# Altium schematic sheet IR180-19_5GF.SchDoc
size A4
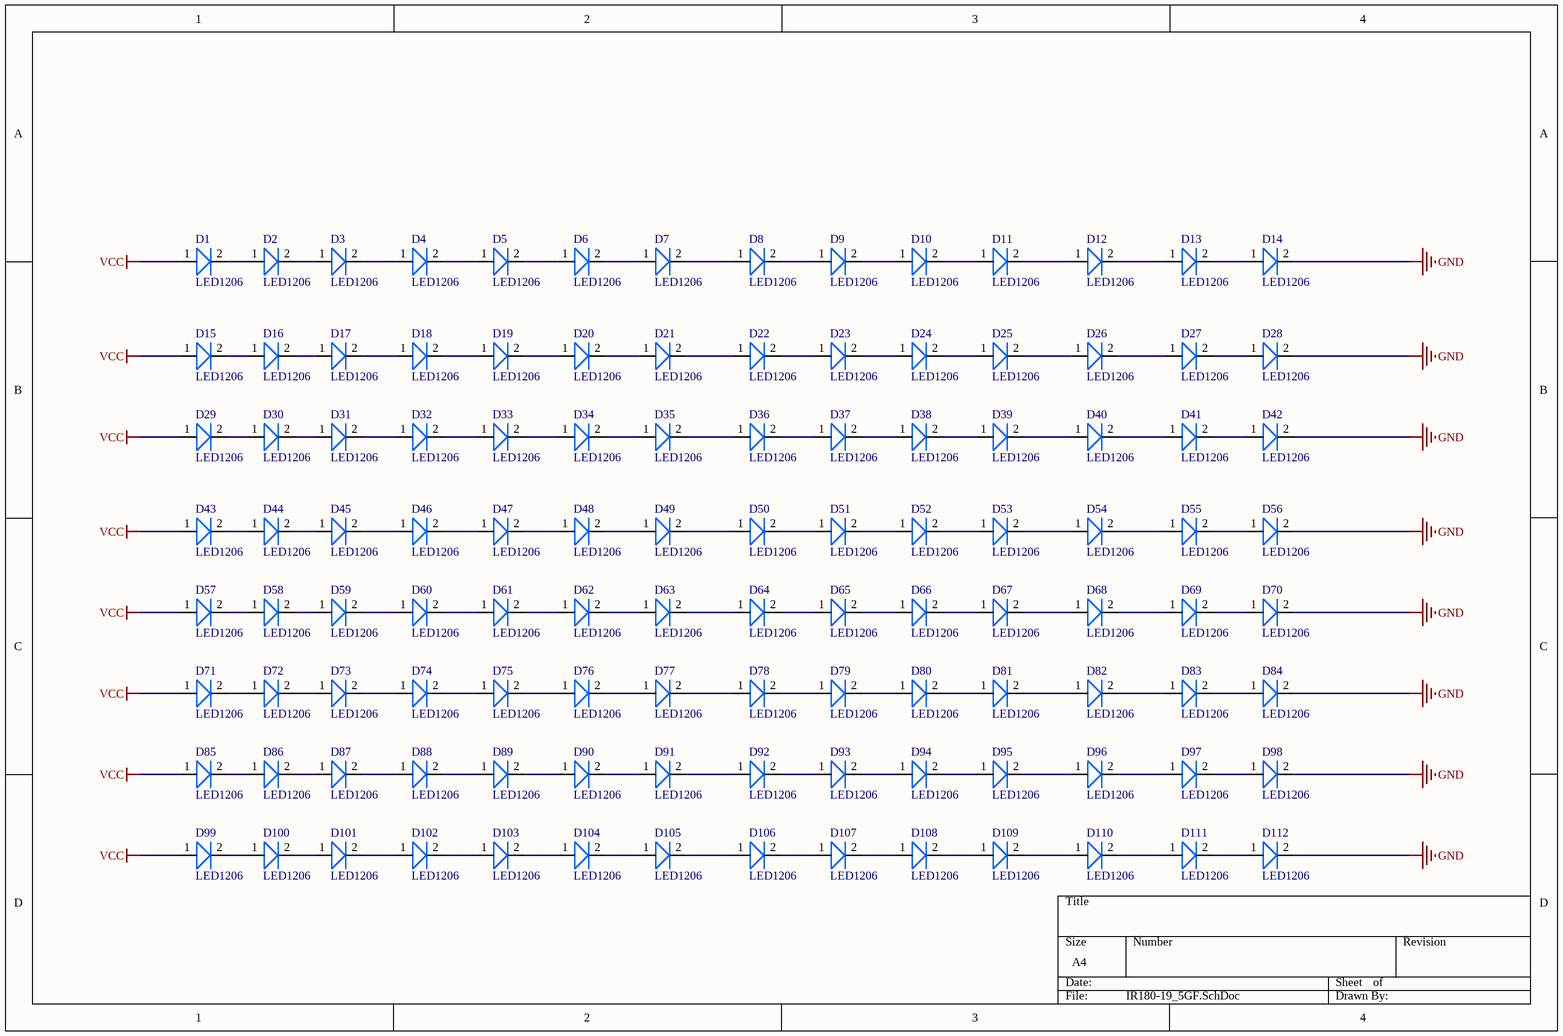
[diagram p0: IR180-19_5GF.SchDoc]

## Parts
D1  LED1206  [IRLED2835M]
D2  LED1206  [IRLED2835M]
D3  LED1206  [IRLED2835M]
D4  LED1206  [IRLED2835M]
D5  LED1206  [IRLED2835M]
D6  LED1206  [IRLED2835M]
D7  LED1206  [IRLED2835M]
D8  LED1206  [IRLED2835M]
D9  LED1206  [IRLED2835M]
D10  LED1206  [IRLED2835M]
D11  LED1206  [IRLED2835M]
D12  LED1206  [IRLED2835M]
D13  LED1206  [IRLED2835M]
D14  LED1206  [IRLED2835M]
D15  LED1206  [IRLED2835M]
D16  LED1206  [IRLED2835M]
D17  LED1206  [IRLED2835M]
D18  LED1206  [IRLED2835M]
D19  LED1206  [IRLED2835M]
D20  LED1206  [IRLED2835M]
D21  LED1206  [IRLED2835M]
D22  LED1206  [IRLED2835M]
D23  LED1206  [IRLED2835M]
D24  LED1206  [IRLED2835M]
D25  LED1206  [IRLED2835M]
D26  LED1206  [IRLED2835M]
D27  LED1206  [IRLED2835M]
D28  LED1206  [IRLED2835M]
D29  LED1206  [IRLED2835M]
D30  LED1206  [IRLED2835M]
D31  LED1206  [IRLED2835M]
D32  LED1206  [IRLED2835M]
D33  LED1206  [IRLED2835M]
D34  LED1206  [IRLED2835M]
D35  LED1206  [IRLED2835M]
D36  LED1206  [IRLED2835M]
D37  LED1206  [IRLED2835M]
D38  LED1206  [IRLED2835M]
D39  LED1206  [IRLED2835M]
D40  LED1206  [IRLED2835M]
D41  LED1206  [IRLED2835M]
D42  LED1206  [IRLED2835M]
D43  LED1206  [IRLED2835M]
D44  LED1206  [IRLED2835M]
D45  LED1206  [IRLED2835M]
D46  LED1206  [IRLED2835M]
D47  LED1206  [IRLED2835M]
D48  LED1206  [IRLED2835M]
D49  LED1206  [IRLED2835M]
D50  LED1206  [IRLED2835M]
D51  LED1206  [IRLED2835M]
D52  LED1206  [IRLED2835M]
D53  LED1206  [IRLED2835M]
D54  LED1206  [IRLED2835M]
D55  LED1206  [IRLED2835M]
D56  LED1206  [IRLED2835M]
D57  LED1206  [IRLED2835M]
D58  LED1206  [IRLED2835M]
D59  LED1206  [IRLED2835M]
D60  LED1206  [IRLED2835M]
D61  LED1206  [IRLED2835M]
D62  LED1206  [IRLED2835M]
D63  LED1206  [IRLED2835M]
D64  LED1206  [IRLED2835M]
D65  LED1206  [IRLED2835M]
D66  LED1206  [IRLED2835M]
D67  LED1206  [IRLED2835M]
D68  LED1206  [IRLED2835M]
D69  LED1206  [IRLED2835M]
D70  LED1206  [IRLED2835M]
D71  LED1206  [IRLED2835M]
D72  LED1206  [IRLED2835M]
D73  LED1206  [IRLED2835M]
D74  LED1206  [IRLED2835M]
D75  LED1206  [IRLED2835M]
D76  LED1206  [IRLED2835M]
D77  LED1206  [IRLED2835M]
D78  LED1206  [IRLED2835M]
D79  LED1206  [IRLED2835M]
D80  LED1206  [IRLED2835M]
D81  LED1206  [IRLED2835M]
D82  LED1206  [IRLED2835M]
D83  LED1206  [IRLED2835M]
D84  LED1206  [IRLED2835M]
D85  LED1206  [IRLED2835M]
D86  LED1206  [IRLED2835M]
D87  LED1206  [IRLED2835M]
D88  LED1206  [IRLED2835M]
D89  LED1206  [IRLED2835M]
D90  LED1206  [IRLED2835M]
D91  LED1206  [IRLED2835M]
D92  LED1206  [IRLED2835M]
D93  LED1206  [IRLED2835M]
D94  LED1206  [IRLED2835M]
D95  LED1206  [IRLED2835M]
D96  LED1206  [IRLED2835M]
D97  LED1206  [IRLED2835M]
D98  LED1206  [IRLED2835M]
D99  LED1206  [IRLED2835M]
D100  LED1206  [IRLED2835M]
D101  LED1206  [IRLED2835M]
D102  LED1206  [IRLED2835M]
D103  LED1206  [IRLED2835M]
D104  LED1206  [IRLED2835M]
D105  LED1206  [IRLED2835M]
D106  LED1206  [IRLED2835M]
D107  LED1206  [IRLED2835M]
D108  LED1206  [IRLED2835M]
D109  LED1206  [IRLED2835M]
D110  LED1206  [IRLED2835M]
D111  LED1206  [IRLED2835M]
D112  LED1206  [IRLED2835M]

## Nets
GND: D14.2(-) D28.2(-) D42.2(-) D56.2(-) D70.2(-) D84.2(-) D98.2(-) D112.2(-)
VCC: D1.1(+) D15.1(+) D29.1(+) D43.1(+) D57.1(+) D71.1(+) D85.1(+) D99.1(+)
NetD1_2: D1.2(-) D2.1(+)
NetD2_2: D2.2(-) D3.1(+)
NetD3_2: D3.2(-) D4.1(+)
NetD4_2: D4.2(-) D5.1(+)
NetD5_2: D5.2(-) D6.1(+)
NetD6_2: D6.2(-) D7.1(+)
NetD7_2: D7.2(-) D8.1(+)
NetD8_2: D8.2(-) D9.1(+)
NetD9_2: D9.2(-) D10.1(+)
NetD10_2: D10.2(-) D11.1(+)
NetD11_2: D11.2(-) D12.1(+)
NetD12_2: D12.2(-) D13.1(+)
NetD13_2: D13.2(-) D14.1(+)
NetD15_2: D15.2(-) D16.1(+)
NetD16_2: D16.2(-) D17.1(+)
NetD17_2: D17.2(-) D18.1(+)
NetD18_2: D18.2(-) D19.1(+)
NetD19_2: D19.2(-) D20.1(+)
NetD20_2: D20.2(-) D21.1(+)
NetD21_2: D21.2(-) D22.1(+)
NetD22_2: D22.2(-) D23.1(+)
NetD23_2: D23.2(-) D24.1(+)
NetD24_2: D24.2(-) D25.1(+)
NetD25_2: D25.2(-) D26.1(+)
NetD26_2: D26.2(-) D27.1(+)
NetD27_2: D27.2(-) D28.1(+)
NetD29_2: D29.2(-) D30.1(+)
NetD30_2: D30.2(-) D31.1(+)
NetD31_2: D31.2(-) D32.1(+)
NetD32_2: D32.2(-) D33.1(+)
NetD33_2: D33.2(-) D34.1(+)
NetD34_2: D34.2(-) D35.1(+)
NetD35_2: D35.2(-) D36.1(+)
NetD36_2: D36.2(-) D37.1(+)
NetD37_2: D37.2(-) D38.1(+)
NetD38_2: D38.2(-) D39.1(+)
NetD39_2: D39.2(-) D40.1(+)
NetD40_2: D40.2(-) D41.1(+)
NetD41_2: D41.2(-) D42.1(+)
NetD43_2: D43.2(-) D44.1(+)
NetD44_2: D44.2(-) D45.1(+)
NetD45_2: D45.2(-) D46.1(+)
NetD46_2: D46.2(-) D47.1(+)
NetD47_2: D47.2(-) D48.1(+)
NetD48_2: D48.2(-) D49.1(+)
NetD49_2: D49.2(-) D50.1(+)
NetD50_2: D50.2(-) D51.1(+)
NetD51_2: D51.2(-) D52.1(+)
NetD52_2: D52.2(-) D53.1(+)
NetD53_2: D53.2(-) D54.1(+)
NetD54_2: D54.2(-) D55.1(+)
NetD55_2: D55.2(-) D56.1(+)
NetD57_2: D57.2(-) D58.1(+)
NetD58_2: D58.2(-) D59.1(+)
NetD59_2: D59.2(-) D60.1(+)
NetD60_2: D60.2(-) D61.1(+)
NetD61_2: D61.2(-) D62.1(+)
NetD62_2: D62.2(-) D63.1(+)
NetD63_2: D63.2(-) D64.1(+)
NetD64_2: D64.2(-) D65.1(+)
NetD65_2: D65.2(-) D66.1(+)
NetD66_2: D66.2(-) D67.1(+)
NetD67_2: D67.2(-) D68.1(+)
NetD68_2: D68.2(-) D69.1(+)
NetD69_2: D69.2(-) D70.1(+)
NetD71_2: D71.2(-) D72.1(+)
NetD72_2: D72.2(-) D73.1(+)
NetD73_2: D73.2(-) D74.1(+)
NetD74_2: D74.2(-) D75.1(+)
NetD75_2: D75.2(-) D76.1(+)
NetD76_2: D76.2(-) D77.1(+)
NetD77_2: D77.2(-) D78.1(+)
NetD78_2: D78.2(-) D79.1(+)
NetD79_2: D79.2(-) D80.1(+)
NetD80_2: D80.2(-) D81.1(+)
NetD81_2: D81.2(-) D82.1(+)
NetD82_2: D82.2(-) D83.1(+)
NetD83_2: D83.2(-) D84.1(+)
NetD85_2: D85.2(-) D86.1(+)
NetD86_2: D86.2(-) D87.1(+)
NetD87_2: D87.2(-) D88.1(+)
NetD88_2: D88.2(-) D89.1(+)
NetD89_2: D89.2(-) D90.1(+)
NetD90_2: D90.2(-) D91.1(+)
NetD91_2: D91.2(-) D92.1(+)
NetD92_2: D92.2(-) D93.1(+)
NetD93_2: D93.2(-) D94.1(+)
NetD94_2: D94.2(-) D95.1(+)
NetD95_2: D95.2(-) D96.1(+)
NetD96_2: D96.2(-) D97.1(+)
NetD97_2: D97.2(-) D98.1(+)
NetD99_2: D99.2(-) D100.1(+)
NetD100_2: D100.2(-) D101.1(+)
NetD101_2: D101.2(-) D102.1(+)
NetD102_2: D102.2(-) D103.1(+)
NetD103_2: D103.2(-) D104.1(+)
NetD104_2: D104.2(-) D105.1(+)
NetD105_2: D105.2(-) D106.1(+)
NetD106_2: D106.2(-) D107.1(+)
NetD107_2: D107.2(-) D108.1(+)
NetD108_2: D108.2(-) D109.1(+)
NetD109_2: D109.2(-) D110.1(+)
NetD110_2: D110.2(-) D111.1(+)
NetD111_2: D111.2(-) D112.1(+)